# EAGLE design FullColorLED (EAGLE 5.11)
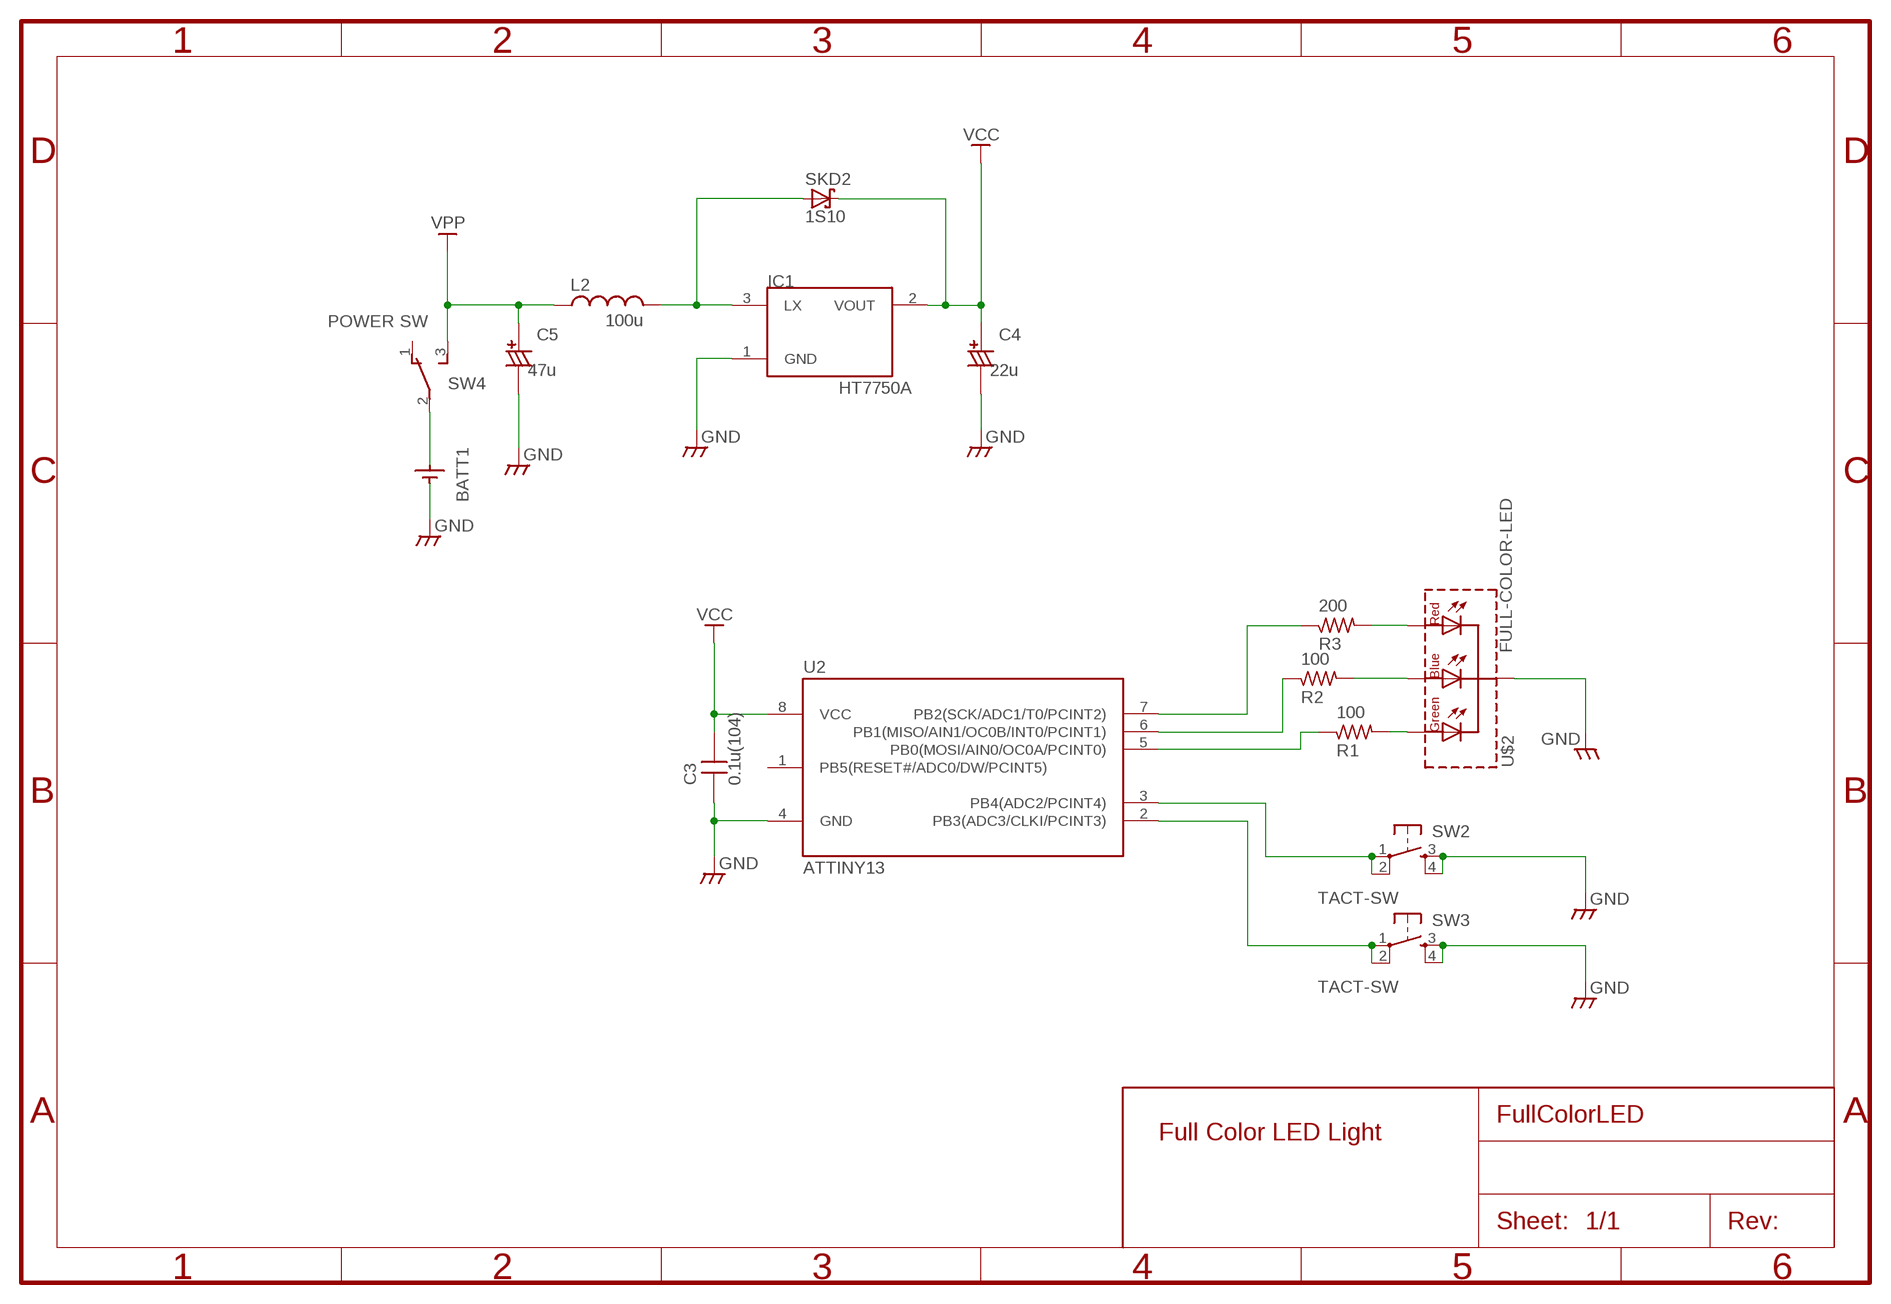
[diagram p0: schematic, sheet 1]

## Parts
BATT1  BH411-1P  [BH411-1P]
C3  0.1u(104)  CAPDIP_2  [CAP_DIP_2]
C4  22u  CCAP6.5  [CCAP_6.5]
C5  47u  CCAP6.5  [CCAP_6.5]
IC1  HT7750A  [TO92_TRI]
L2  100u  L-US0207/7  [0207/7]
R1  100  R0.125W_1P  [R_0.125W_1]
R2  100  R0.125W_1P  [R_0.125W_1]
R3  200  R0.125W_1P  [R_0.125W_1]
SKD2  1S10  [R-1]
SW2  TACT-SW  [B3F-10X]
SW3  TACT-SW  [B3F-10X]
SW4  POWER SW  SLIDESW-3  [DS-3-SIDE]
U2  ATTINY13  TINY138P3  [DIL08]
U$2  FULL-COLOR-LED  [OSTA-LED]

## Nets
GND: BATT1.BATT-MINUS(MINUS) C3.1 C4.- C5.- IC1.1(GND) SW2.3(S) SW2.4(S1) SW3.3(S) SW3.4(S1) U2.4(GND) U$2.P$3(COMMON-C)
N$1: BATT1.BATT-PLUS(PLUS) SW4.2(P)
N$2: R1.2 U$2.P$1(GREEN-A)
N$3: R2.2 U$2.P$2(BLUE-A)
N$4: R3.2 U$2.P$4(RED-A)
N$5: SW3.1(P) SW3.2(P1) U2.2(PB3(ADC3/CLKI/PCINT3))
N$6: R2.1 U2.6(PB1(MISO/AIN1/OC0B/INT0/PCINT1))
N$7: R3.1 U2.7(PB2(SCK/ADC1/T0/PCINT2))
N$9: R1.1 U2.5(PB0(MOSI/AIN0/OC0A/PCINT0))
N$11: IC1.3(LX) L2.2 SKD2.1-A(A)
N$14: SW2.1(P) SW2.2(P1) U2.3(PB4(ADC2/PCINT4))
VCC: C3.2 C4.+ IC1.2(VOUT) SKD2.2-K(K) U2.8(VCC)
VPP: C5.+ L2.1 SW4.3(S)
Unconnected: SW4.1(O) U2.1(PB5(RESET#/ADC0/DW/PCINT5))

## Notes on the sheet
- Full Color LED Light

## Library data of the parts
BATT1 = densikit:BH411-1P
C3 = MyLib:CAP: Non polar capacitor
C4 C5 = MyLib:CCAP: Polar capacitor
IC1 = keinSoft-01:HT7750A: PFM Step-up DC/DC Converter HT7750A Input: 0.7V ~ , Output: 5.0V
L2 = rcl:L-US: INDUCTOR, American symbol
R1-R3 = MyLib:R: General Resiter 1/8W 1/4W 1/2W V/H
SKD2 = keinSoft-01:1S10: Shotkey barrier diode 1S10 100V, 1A
SW2 SW3 = MyLib:TACT-SW: Tacticle Push Switch
SW4 = MyLib:SLIDESW-3: 3P Slide Switch
U2 = atmel:TINY13*
U$2 = led:FULL-COLOR-LED

## Board
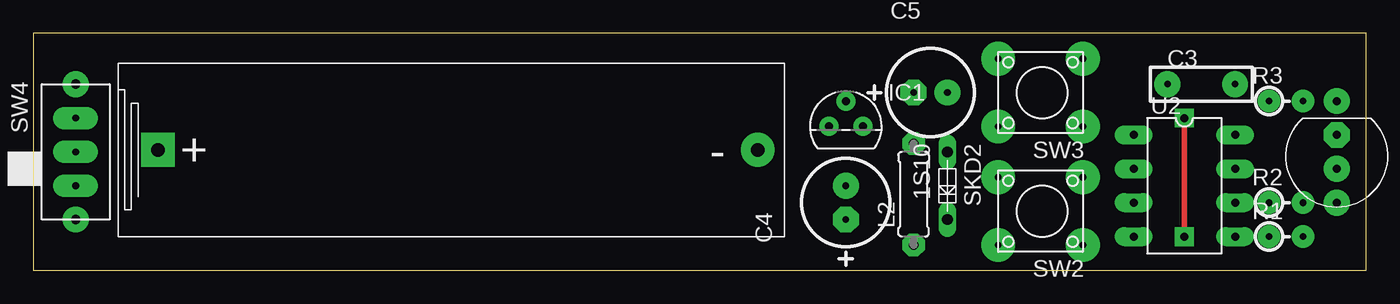
[diagram p1: board, top side]
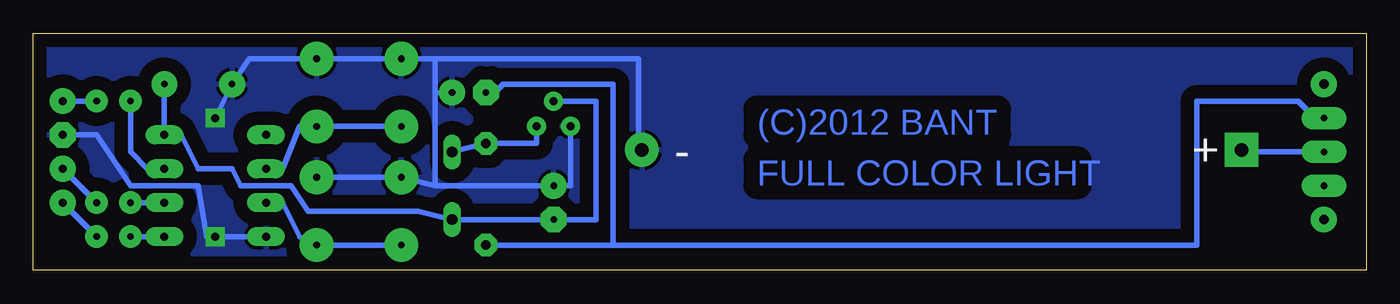
[diagram p2: board, bottom side, seen from below]

Size 100 x 17.78 mm. Coordinates in mm from the lower left corner, seen from the top.
Outline: 0,0 100,0 100,17.78 0,17.78 0,0
Copper layers (1*16): Top 0.035mm / dielectric 1.5mm / Bottom 0.035mm
Design rules "default": minimum track width 10mil, minimum drill 24mil, track to track 8mil, track to pad 8mil, pad to pad 8mil, via to via 8mil, smd to smd 8mil, copper to edge 40mil, drill to drill 8mil, minimum pad ring 10mil, minimum via ring 8mil, stop-mask expansion 4mil, vias tented up to drill 0mil, thermal gap 10mil

### Footprints (pad centres in the part's own frame; a part is rotated, then mirrored left to right if it is on the bottom)
BH411-1P = drill 1 pad 2.54 round: BATT-MINUS 48,6.5 | drill 1 pad 2.54 square: BATT-PLUS 3,6.5
CAP_DIP_2 = drill 0.5 pad 1.93 round: 1 -2.54,0; 2 2.54,0
CCAP_6.5 = drill 0.5 pad 1.93 octagon: + -1.27,0 | drill 0.5 pad 1.93 round: - 1.27,0
TO92_TRI = drill 0.6 pad 1.422 round: 1 -1.27,0; 2 0,1.905; 3 1.27,0
0207/7 = drill 0.7 pad 1.676 octagon: 1 -3.81,0; 2 3.81,0
R_0.125W_1 = drill 0.5 pad 1.676 round: 1 -1.27,0; 2 1.27,0
R-1 = drill 0.8 long: 1-A -2.54,0; 2-K 2.54,0
B3F-10X = drill 0.5 pad 2.54 round: 1 -1.27,2.54; 2 5.08,2.54; 3 -1.27,-2.54; 4 5.08,-2.54
DS-3-SIDE = drill 0.5 pad 1.676 long: 1 0,-2.54; 2 0,0; 3 0,2.54 | drill 0.7 pad 1.93 round: P$1 0,5.08; P$2 0,-5.08
DIL08 = drill 0.6 pad 1.422 long: 1 -3.81,-3.81; 2 -1.27,-3.81; 3 1.27,-3.81; 4 3.81,-3.81; 5 3.81,3.81; 6 1.27,3.81; 7 -1.27,3.81; 8 -3.81,3.81
OSTA-LED = drill 0.6 pad 1.93 round: P$1 -3.81,0; P$2 -1.27,0; P$4 3.81,0 | drill 0.6 pad 1.93 octagon: P$3 1.27,0

### Placement (x,y rotation side)
BATT1  6.35,2.54 0 top
C3  87.63,13.97 0 top
C4  60.96,5.08 90 top
C5  67.31,13.34 0 top
IC1  60.96,10.79 0 top
L2  66.04,5.71 90 top
R1  93.98,2.54 0 top
R2  93.98,5.08 0 top
R3  93.98,12.7 0 top
SKD2  68.58,6.35 270 top
SW2  77.47,4.45 180 top
SW3  77.47,13.34 180 top
SW4  3.17,8.89 0 top
U2  86.36,6.35 270 top
U$2  97.79,8.89 90 top

### Tracks (layer width: path | path; a pad name or v marks a point on that pad's centre or on a via)
GND  (via drill 0.6 pad 1.42)
  Top 0.406: v86.36,11.43 v86.36,2.54
  Bottom 0.406: IC1.1 59.69,6.35 C4.- 69.85,6.35 | SW2.3 SW2.4 69.85,6.35 | U2.4 v86.36,2.54 87,2.54 87.63,6.35 92.71,6.35 95.25,10.16 U$2.P$3 | BATT1.BATT-MINUS 54.61,9.53 54.61,15.88 69.85,15.88 | 69.85,15.88 SW3.4 SW3.3 83.82,15.88 C3.1 v86.36,11.43 | 69.85,15.88 69.85,13.34 | 69.85,13.34 C5.- | 69.85,13.34 69.85,6.35
  pour Bottom (isolate 1.016): 0,17.78 0,0 100.33,0 100.33,17.78
N$1
  Bottom 0.406: SW4.2 8.89,8.89 BATT1.BATT-PLUS
N$2
  Bottom 0.406: R1.2 U$2.P$1
N$3
  Bottom 0.406: R2.2 U$2.P$2
N$4
  Bottom 0.406: R3.2 U$2.P$4
N$5
  Bottom 0.406: U2.2 81.28,7.62 80.01,10.79 SW3.1 SW3.2
N$6
  Bottom 0.406: U2.6 R2.1
N$7
  Bottom 0.406: U2.7 91.44,7.62 92.71,8.89 R3.1
N$9
  Bottom 0.406: U2.5 R1.1
N$11
  Bottom 0.406: SKD2.1-A L2.2 62.23,9.53 IC1.3
N$14
  Bottom 0.406: U2.3 81.28,5.08 80.01,2.54 SW2.1 SW2.2
VCC
  Bottom 0.406: C3.2 U2.8 88.9,10.16 87.63,7.62 85.09,7.62 84.45,6.35 80.64,6.35 79.38,4.45 71.12,4.45 SKD2.2-K C4.+ 57.78,3.81 57.78,12.7 IC1.2
VPP
  Bottom 0.406: C5.+ 65.41,13.34 64.77,13.97 56.52,13.97 56.52,1.91 | SW4.3 3.81,11.43 5.08,12.7 12.7,12.7 12.7,1.91 56.52,1.91 | 56.52,1.91 L2.1

### Text on the board
Bottom: (C)2012 BANT | FULL COLOR LIGHT